# EAGLE design breakout (EAGLE 9.1.2)
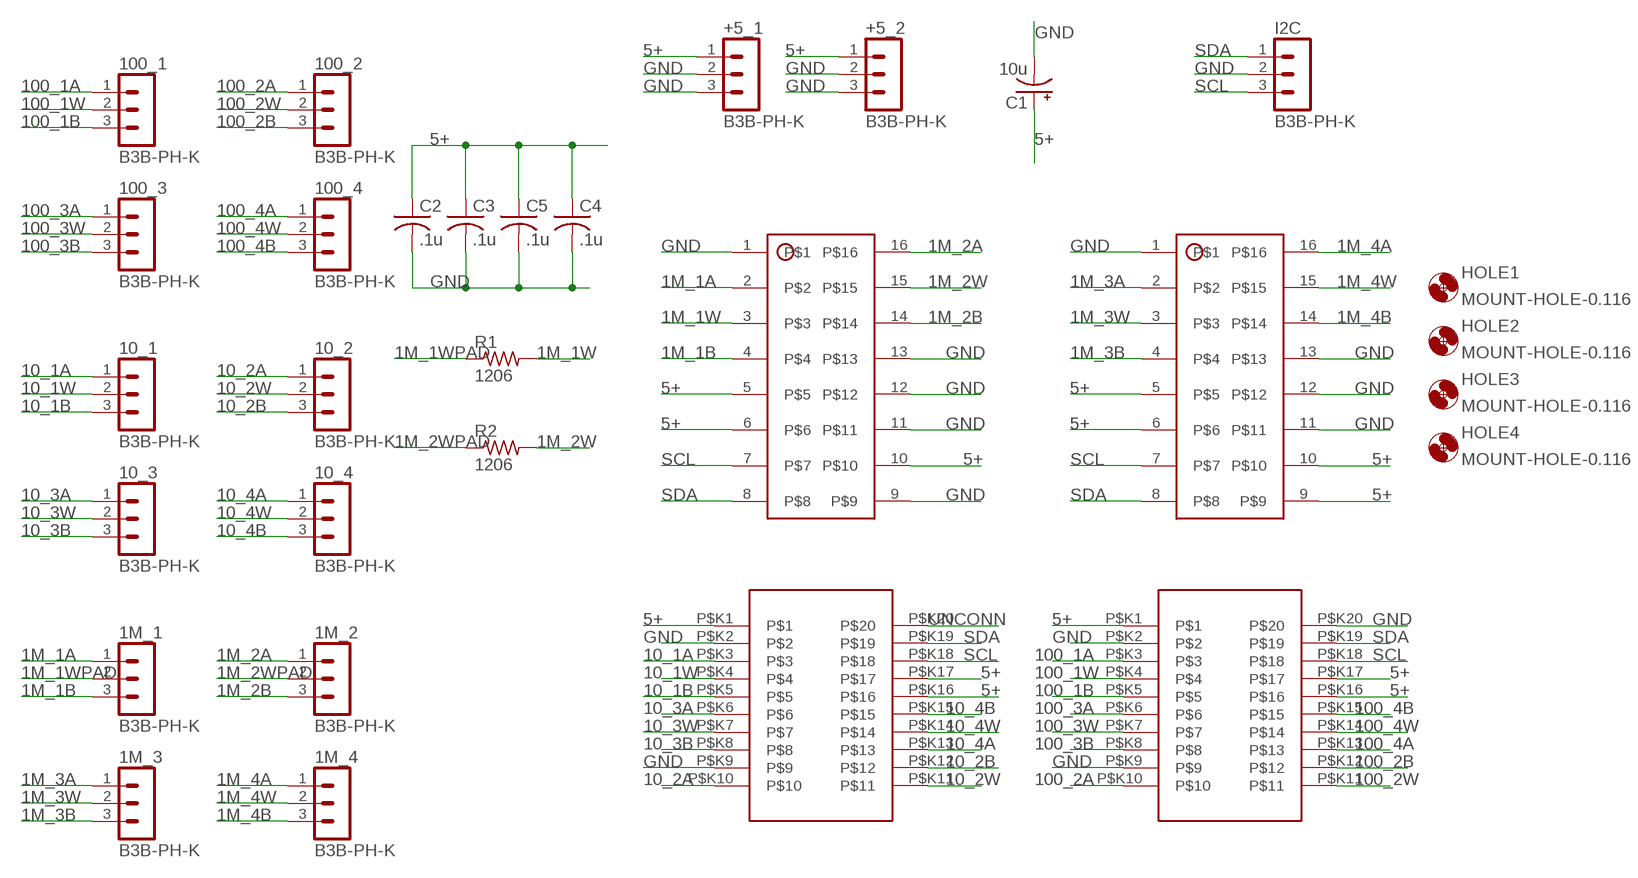
[diagram p0: schematic, sheet 1]

## Parts
1M_1  B3B-PH-K  [B3B-PH-K]
1M_2  B3B-PH-K  [B3B-PH-K]
1M_3  B3B-PH-K  [B3B-PH-K]
1M_4  B3B-PH-K  [B3B-PH-K]
10_1  B3B-PH-K  [B3B-PH-K]
10_2  B3B-PH-K  [B3B-PH-K]
10_3  B3B-PH-K  [B3B-PH-K]
10_4  B3B-PH-K  [B3B-PH-K]
10K  TSSOP20  [TSSOP20]
100_1  B3B-PH-K  [B3B-PH-K]
100_2  B3B-PH-K  [B3B-PH-K]
100_3  B3B-PH-K  [B3B-PH-K]
100_4  B3B-PH-K  [B3B-PH-K]
100K  TSSOP20  [TSSOP20]
+5_1  B3B-PH-K  [B3B-PH-K]
+5_2  B3B-PH-K  [B3B-PH-K]
C1  10u  CPOL-USE3.5-8  [E3,5-8]
C2  .1u  C-USC1206K  [C1206K]
C3  .1u  C-USC1206K  [C1206K]
C4  .1u  C-USC1206K  [C1206K]
C5  .1u  C-USC1206K  [C1206K]
HOLE1  MOUNT-HOLE-0.116  [116]
HOLE2  MOUNT-HOLE-0.116  [116]
HOLE3  MOUNT-HOLE-0.116  [116]
HOLE4  MOUNT-HOLE-0.116  [116]
I2C  B3B-PH-K  [B3B-PH-K]
MEG_1  SOIC-16  [SOIC127P600X175-16N]
MEG_2  SOIC-16  [SOIC127P600X175-16N]
R1  1206  R-US_R1206  [R1206]
R2  1206  R-US_R1206  [R1206]

## Nets
1M_1A: 1M_1.1 MEG_1.2
1M_1B: 1M_1.3 MEG_1.4
1M_1W: MEG_1.3 R1.2
1M_1WPAD: 1M_1.2 R1.1
1M_2A: 1M_2.1 MEG_1.16
1M_2B: 1M_2.3 MEG_1.14
1M_2W: MEG_1.15 R2.2
1M_2WPAD: 1M_2.2 R2.1
1M_3A: 1M_3.1 MEG_2.2
1M_3B: 1M_3.3 MEG_2.4
1M_3W: 1M_3.2 MEG_2.3
1M_4A: 1M_4.1 MEG_2.16
1M_4B: 1M_4.3 MEG_2.14
1M_4W: 1M_4.2 MEG_2.15
5+: 10K.P$K1 10K.P$K16 10K.P$K17 100K.P$K1 100K.P$K16 100K.P$K17 +5_1.1 +5_2.1 C1.+ C2.1 C3.1 C4.1 C5.1 MEG_1.5 MEG_1.6 MEG_1.10 MEG_2.5 MEG_2.6 MEG_2.9 MEG_2.10
10_1A: 10_1.1 10K.P$K3
10_1B: 10_1.3 10K.P$K5
10_1W: 10_1.2 10K.P$K4
10_2A: 10_2.1 10K.P$K10
10_2B: 10_2.3 10K.P$K12
10_2W: 10_2.2 10K.P$K11
10_3A: 10_3.1 10K.P$K6
10_3B: 10_3.3 10K.P$K8
10_3W: 10_3.2 10K.P$K7
10_4A: 10_4.1 10K.P$K13
10_4B: 10_4.3 10K.P$K15
10_4W: 10_4.2 10K.P$K14
100_1A: 100_1.1 100K.P$K3
100_1B: 100_1.3 100K.P$K5
100_1W: 100_1.2 100K.P$K4
100_2A: 100_2.1 100K.P$K10
100_2B: 100_2.3 100K.P$K12
100_2W: 100_2.2 100K.P$K11
100_3A: 100_3.1 100K.P$K6
100_3B: 100_3.3 100K.P$K8
100_3W: 100_3.2 100K.P$K7
100_4A: 100_4.1 100K.P$K13
100_4B: 100_4.3 100K.P$K15
100_4W: 100_4.2 100K.P$K14
GND: 10K.P$K2 10K.P$K9 100K.P$K2 100K.P$K9 100K.P$K20 +5_1.2 +5_1.3 +5_2.2 +5_2.3 C1.- C2.2 C3.2 C4.2 C5.2 I2C.2 MEG_1.1 MEG_1.9 MEG_1.11 MEG_1.12 MEG_1.13 MEG_2.1 MEG_2.11 MEG_2.12 MEG_2.13
SCL: 10K.P$K18 100K.P$K18 I2C.3 MEG_1.7 MEG_2.7
SDA: 10K.P$K19 100K.P$K19 I2C.1 MEG_1.8 MEG_2.8
UNCONN: 10K.P$K20

## Library data of the parts
1M_1-1M_4 10_1-10_4 100_1-100_4 +5_1 +5_2 I2C = con-jst-ph:B3B-PH-K: HEADER
10K 100K = kevin:TSSOP20
C1 = rcl:CPOL-US: POLARIZED CAPACITOR, American symbol; SPICEPREFIX: C
C2-C5 = rcl:C-US: CAPACITOR, American symbol; SPICEPREFIX: C
HOLE1-HOLE4 = holes:MOUNT-HOLE-: MOUNTING HOLE with drill center marker; BOM: EXCLUDE
MEG_1 MEG_2 = EFM8BB10F8I-A-SOIC16:SOIC-16
R1 R2 = rcl:R-US_: RESISTOR, American symbol; SPICEPREFIX: R

## Board
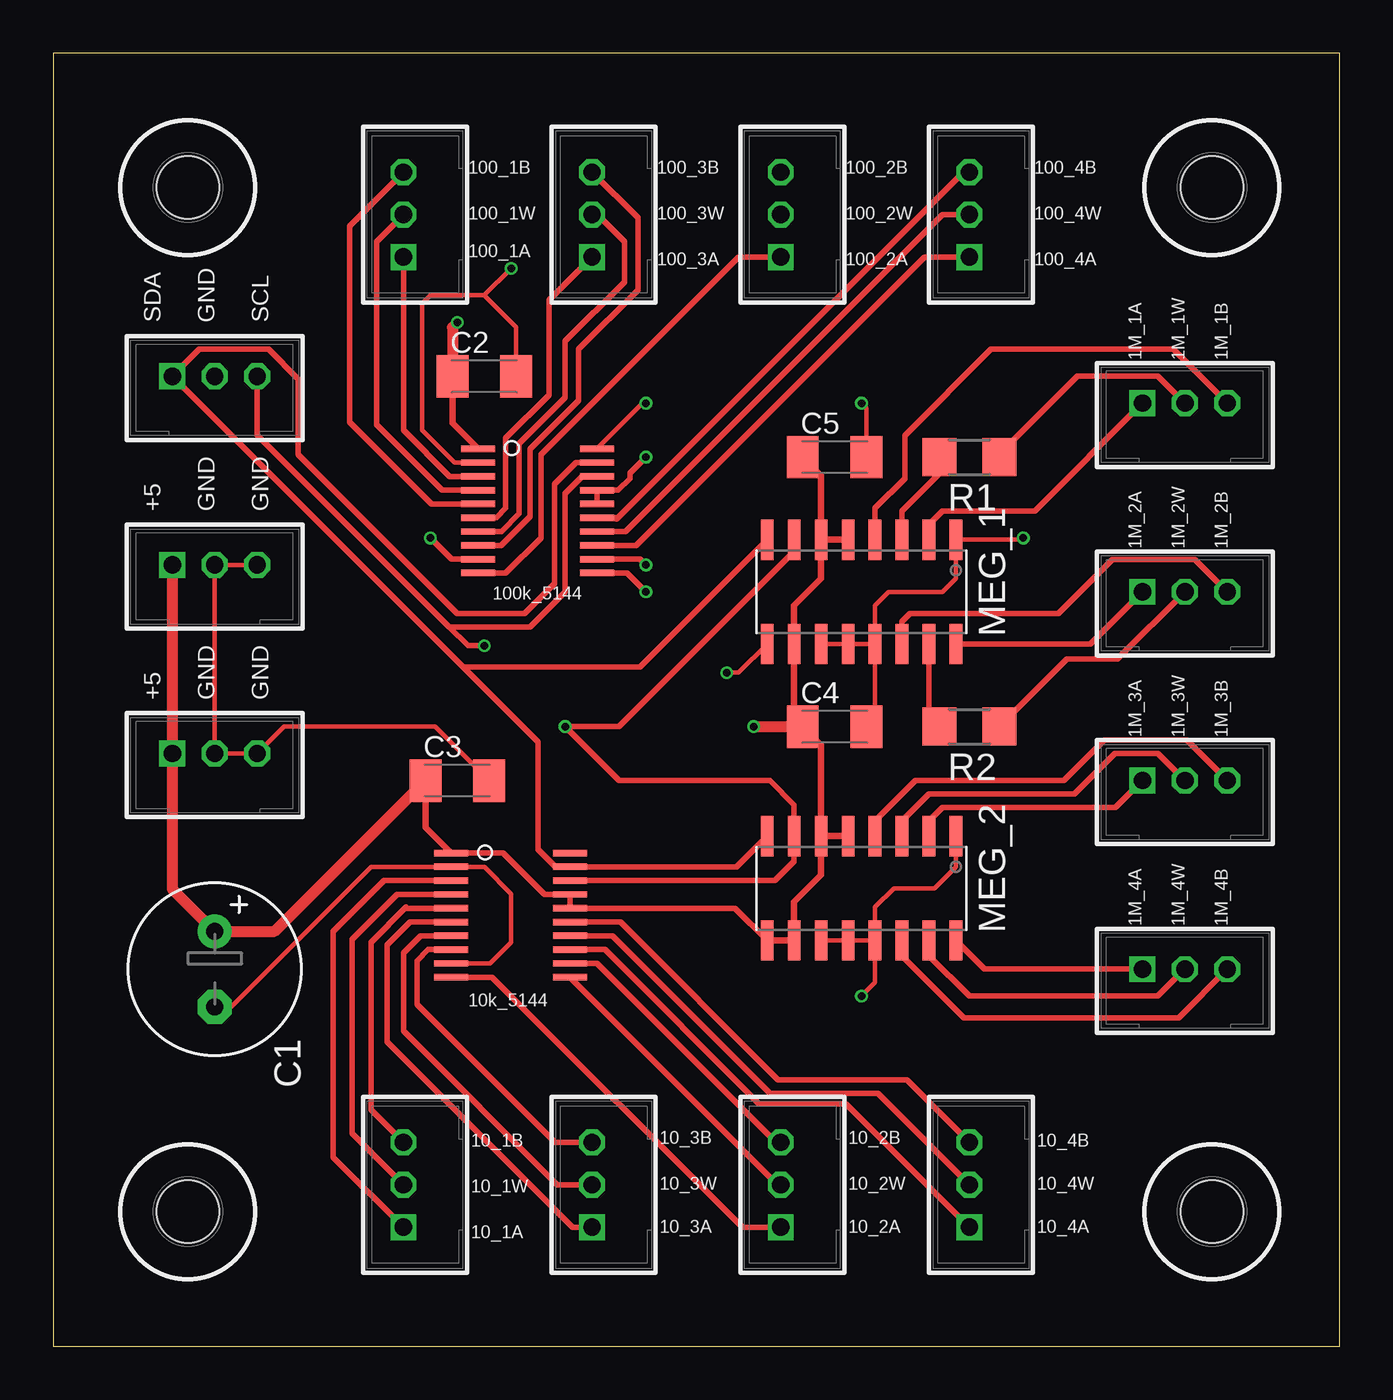
[diagram p1: board, top side]
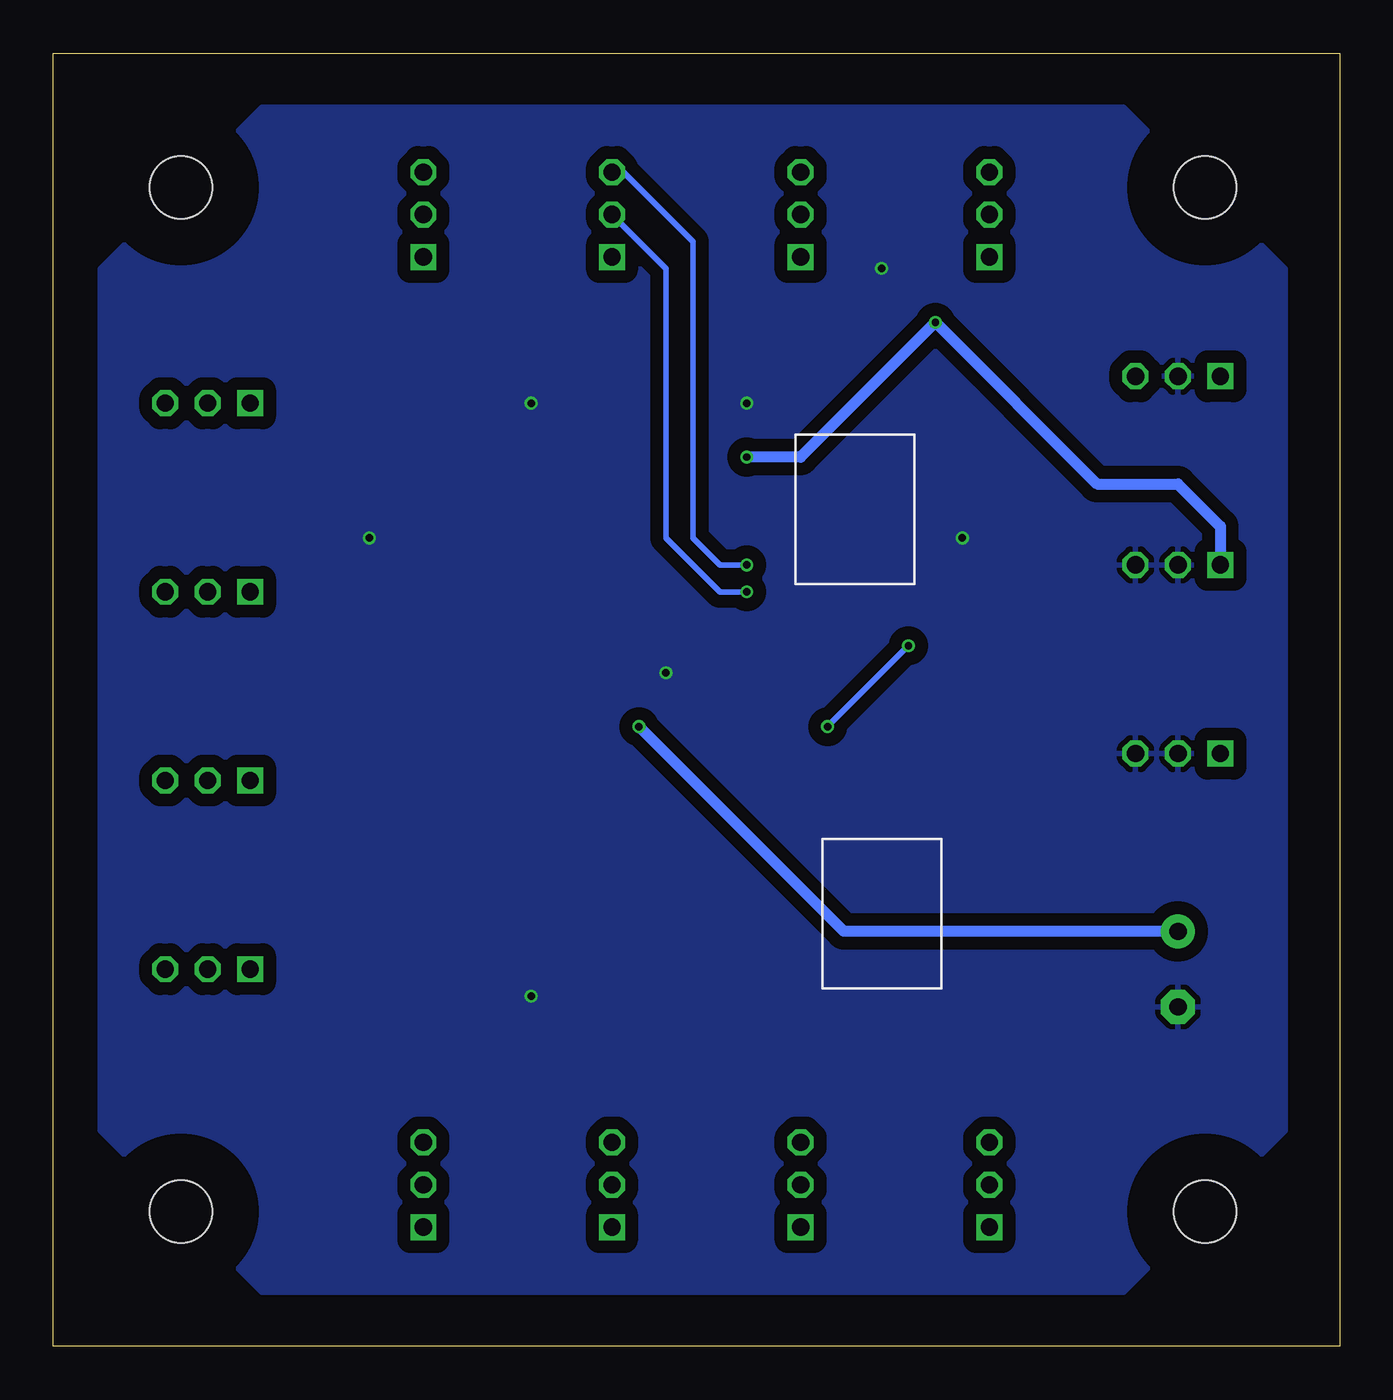
[diagram p2: board, bottom side, seen from below]

Size 60.63 x 60.95 mm. Coordinates in mm from the lower left corner, seen from the top.
Outline: 0,0 60.63,0 60.63,60.95 0,60.95 0,0
Copper layers (1*16): Top 0.035559375mm / dielectric 1.6mm / Bottom 0.035559375mm
Design rules "oshpark-2layer": minimum track width 6mil, minimum drill 10mil, track to track 6mil, track to pad 6mil, pad to pad 6mil, via to via 6mil, smd to smd 6mil, copper to edge 15mil, drill to drill 6mil, minimum pad ring 5mil, minimum via ring 5mil, stop-mask expansion 2.5mil, vias tented up to drill 0mil, thermal gap 10mil

### Footprints (pad centres in the part's own frame; a part is rotated, then mirrored left to right if it is on the bottom)
B3B-PH-K = drill 0.813 square: 1 -2,0 | drill 0.813 octagon: 2 0,0; 3 2,0
TSSOP20 = smd 0.3 x 1.6: P$K1 -2.93,-2.825; P$K2 -2.28,-2.825; P$K3 -1.63,-2.825; P$K4 -0.98,-2.825; P$K5 -0.33,-2.825; P$K6 0.32,-2.825; P$K7 0.97,-2.825; P$K8 1.62,-2.825; P$K9 2.27,-2.825; P$K10 2.92,-2.825; P$K11 2.92,2.775; P$K12 2.27,2.775; P$K13 1.62,2.775; P$K14 0.97,2.775; P$K15 0.32,2.775; P$K16 -0.33,2.775; P$K17 -0.98,2.775; P$K18 -1.63,2.775; P$K19 -2.28,2.775; P$K20 -2.93,2.775
E3,5-8 = drill 0.813 pad 1.6: + -1.778,0 | drill 0.813 pad 1.6 octagon: - 1.778,0
C1206K = smd 1.5 x 2: 1 -1.5,0; 2 1.5,0
116 = hole 2.946: 0,0
SOIC127P600X175-16N = smd 1.9 x 0.6: 1 -2.455,4.445; 2 -2.455,3.175; 3 -2.455,1.905; 4 -2.455,0.635; 5 -2.455,-0.635; 6 -2.455,-1.905; 7 -2.455,-3.175; 8 -2.455,-4.445; 9 2.455,-4.445; 10 2.455,-3.175; 11 2.455,-1.905; 12 2.455,-0.635; 13 2.455,0.635; 14 2.455,1.905; 15 2.455,3.175; 16 2.455,4.445
R1206 = smd 1.6 x 1.803: 1 -1.422,0; 2 1.422,0

### Placement (x,y rotation side)
1M_1  53.34,44.45 0 top
1M_2  53.34,35.56 0 top
1M_3  53.34,26.67 0 top
1M_4  53.34,17.78 0 top
10_1  16.51,7.62 90 top
10_2  34.29,7.62 90 top
10_3  25.4,7.62 90 top
10_4  43.18,7.62 90 top
10K  21.59,20.32 270 top
100_1  16.51,53.34 90 top
100_2  34.29,53.34 90 top
100_3  25.4,53.34 90 top
100_4  43.18,53.34 90 top
100K  22.86,39.37 270 top
+5_1  7.62,36.83 0 top
+5_2  7.62,27.94 0 top
C1  7.62,17.78 270 top
C2  20.32,45.72 0 top
C3  19.05,26.67 0 top
C4  36.83,29.21 0 top
C5  36.83,41.91 0 top
HOLE1  6.35,54.61 0 top
HOLE2  54.61,54.61 0 top
HOLE3  6.35,6.35 0 top
HOLE4  54.61,6.35 0 top
I2C  7.62,45.72 0 top
MEG_1  38.1,35.56 270 top
MEG_2  38.1,21.59 270 top
R1  43.18,41.91 180 top
R2  43.18,29.21 180 top

### Tracks (layer width: path | path; a pad name or v marks a point on that pad's centre or on a via)
1M_1A
  Top 0.254: MEG_1.2 41.27,38.73 41.91,39.37 46.26,39.37 1M_1.1
1M_1B
  Top 0.254: MEG_1.4 38.73,39.5 40.13,40.89 40.13,42.93 44.2,46.99 52.8,46.99 1M_1.3
1M_1W
  Top 0.254: MEG_1.3 40.01,39.37 41.76,41.12 R1.2
1M_1WPAD
  Top 0.254: 1M_1.2 52.07,45.72 48.26,45.72 44.6,42.06 R1.1
1M_2A
  Top 0.254: MEG_1.16 48.88,33.11 1M_2.1
1M_2B
  Top 0.254: MEG_1.14 40.01,34.16 40.39,34.54 47.37,34.54 49.91,37.08 53.82,37.08 1M_2.3
1M_2W
  Top 0.254: MEG_1.15 41.27,29.69 R2.2
1M_2WPAD
  Top 0.254: R2.1 47.78,32.39 50.16,32.39 1M_2.2
1M_3A
  Top 0.254: MEG_2.2 41.27,24.76 41.91,25.4 50.07,25.4 1M_3.1
1M_3B
  Top 0.254: MEG_2.4 38.73,24.76 40.64,26.67 47.62,26.67 49.53,28.57 53.44,28.57 1M_3.3
1M_3W
  Top 0.254: MEG_2.3 40.01,24.76 41.27,26.04 48.13,26.04 50.04,27.94 52.07,27.94 1M_3.2
1M_4A
  Top 0.254: MEG_2.16 43.9,17.78 1M_4.1
1M_4B
  Top 0.254: MEG_2.14 40.01,18.42 42.93,15.49 53.05,15.49 1M_4.3
1M_4W
  Top 0.254: MEG_2.15 41.27,18.42 43.18,16.51 52.07,16.51 1M_4.2
5+  (via drill 0.35)
  Top 0.254: 10K.P$K1 21.2,23.25 23.15,21.3 10K.P$K17 10K.P$K16 32.14,20.65 MEG_2.9 | v27.94,41.91 27.18,41.15 27.18,40.89 26.63,40.35 100K.P$K17 100K.P$K16
  Top 0.305: MEG_2.9 MEG_2.10 34.92,20.96 36.2,22.22 MEG_2.6 | MEG_2.6 MEG_2.5 | 10K.P$K1 17.55,24.46 C3.1 | MEG_2.6 36.2,28.35 C4.1 34.92,29.61 MEG_1.10 34.92,34.92 36.2,36.19 MEG_1.6 | MEG_1.6 MEG_1.5 | MEG_1.6 36.2,41.05 C5.1 | C2.1 18.82,43.52 100K.P$K1
  Top 0.508: +5_1.1 +5_2.1 5.62,21.56 C1.+ 10.44,19.56 C3.1 | v33.02,29.21 C4.1 | v19.05,48.26 18.82,48.03 C2.1
  Bottom 0.508: +5_1.1 5.62,38.64 7.62,40.64 11.43,40.64 v19.05,48.26 25.4,41.91 v27.94,41.91 | C1.+ 23.37,19.56 v33.02,29.21
10_1A
  Top 0.254: 10K.P$K3 15.6,21.95 13.21,19.56 13.21,8.92 10_1.1
10_1B
  Top 0.254: 10K.P$K5 16.69,20.65 16.64,20.7 14.99,19.05 14.99,11.14 10_1.3
10_1W
  Top 0.254: 10K.P$K4 16.22,21.3 14.1,19.18 14.1,10.03 10_1.2
10_2A
  Top 0.254: 10K.P$K10 20.7,17.4 32.48,5.62 10_2.1
10_2B
  Top 0.254: 10K.P$K12 25.64,18.05 34.07,9.62 10_2.3
10_2W
  Top 0.254: 10K.P$K11 34.15,7.62 10_2.2
10_3A
  Top 0.254: 10K.P$K6 16.82,20 15.75,18.92 15.75,14.35 24.48,5.62 10_3.1
10_3B
  Top 0.254: 10K.P$K8 17.68,18.7 17.14,18.16 17.14,16.13 23.65,9.62 10_3.3
10_3W
  Top 0.254: 10K.P$K7 17.32,19.35 16.51,18.54 16.51,14.86 23.75,7.62 10_3.2
10_4A
  Top 0.254: 10K.P$K13 26,18.7 33.27,11.43 37.37,11.43 10_4.1
10_4B
  Top 0.254: 10K.P$K15 26.74,20 34.16,12.57 40.23,12.57 10_4.3
10_4W
  Top 0.254: 10K.P$K14 26.37,19.35 33.78,11.94 38.86,11.94 10_4.2
100_1A
  Top 0.254: 100K.P$K3 18.69,41 16.51,43.18 100_1.1
100_1B
  Top 0.254: 100K.P$K5 17.83,39.7 13.97,43.56 13.97,52.8 100_1.3
100_1W
  Top 0.254: 100K.P$K4 18.32,40.35 15.24,43.43 15.24,52.07 100_1.2
100_2A
  Top 0.254: 100K.P$K10 21.34,36.45 22.99,38.1 22.99,42.04 32.29,51.34 100_2.1
100_2B  (via drill 0.35)
  Top 0.254: 100K.P$K12 27.67,37.1 v27.94,36.83
  Bottom 0.254: v27.94,36.83 29.21,36.83 30.48,38.1 30.48,52.07 33.75,55.34 100_2.3
100_2W  (via drill 0.35)
  Top 0.254: 100K.P$K11 27.05,36.45 v27.94,35.56
  Bottom 0.254: v27.94,35.56 29.21,35.56 31.75,38.1 31.75,50.8 100_2.2
100_3A
  Top 0.254: 100K.P$K6 20.89,39.05 21.34,39.5 21.34,42.8 23.37,44.83 23.37,49.31 100_3.1
100_3B
  Top 0.254: 100K.P$K8 21.11,37.75 22.48,39.12 22.48,42.29 24.77,44.58 24.77,46.99 27.56,49.78 27.56,53.18 100_3.3
100_3W
  Top 0.254: 100K.P$K7 21.13,38.4 21.97,39.24 21.97,42.55 24.13,44.7 24.13,47.37 26.92,50.17 26.92,52.07 25.65,53.34 100_3.2
100_4A
  Top 0.254: 100K.P$K13 27.46,37.75 41.05,51.34 100_4.1
100_4B
  Top 0.254: 100K.P$K15 26.48,39.05 26.54,38.99 42.89,55.34 100_4.3
100_4W
  Top 0.254: 100K.P$K14 26.97,38.4 41.91,53.34 100_4.2
GND  (via drill 0.35)
  Top 0.203: +5_1.3 +5_1.2 +5_2.2 +5_2.3 10.89,29.21 18.01,29.21 C3.2 | MEG_2.11 MEG_2.12 MEG_2.13 | MEG_2.13 38.73,20.7 39.62,21.59 41.53,21.59 42.55,22.61 MEG_2.1 | C4.2 38.73,29.61 MEG_1.13 | MEG_1.13 MEG_1.12 MEG_1.11 | MEG_1.13 38.73,34.92 39.37,35.56 41.91,35.56 42.55,36.19 MEG_1.1 45.63,38.02 v45.72,38.1 | 100K.P$K20 27.79,44.45 v27.94,44.45 | 100K.P$K2 18.93,41.65 17.4,43.18 17.4,49.15 17.78,49.53 20.32,49.53 | C2.2 21.82,48.03 20.32,49.53 | 10K.P$K9 20.59,18.05 21.59,19.05 21.59,21.34 20.33,22.6 10K.P$K2 14.98,22.6 8.38,16 C1.- | MEG_2.13 38.73,17.14 v38.1,16.51 | C5.2 38.33,44.22 v38.1,44.45 | MEG_1.9 32.3,31.75 v31.75,31.75 | 20.32,49.53 v21.59,50.8
  Top 0.254: 100K.P$K9 18.78,37.1 v17.78,38.1
  pour Bottom (isolate 0.61): 10.16,58.42 50.8,58.42 58.42,50.8 58.42,10.16 50.8,2.54 10.16,2.54 2.54,10.16 2.54,50.8
SCL  (via drill 0.35)
  Top 0.254: I2C.3 9.62,42.96 18.67,33.91 | 10K.P$K18 34.02,21.95 34.92,22.86 MEG_2.7 34.92,25.53 33.78,26.67 26.67,26.67 v24.13,29.21 26.67,29.21 34.92,37.47 MEG_1.7 | 18.67,33.91 22.48,33.91 24.13,35.56 24.13,40.19 | 18.67,33.91 19.56,33.02 v20.32,33.02 | 24.13,40.19 | 24.13,40.19 24.94,41 100K.P$K18
  Bottom 0.254: v20.32,33.02 v24.13,29.21
SDA
  Top 0.203: 100K.P$K19 25.4,41.65
  Top 0.254: 19.32,32.02 I2C.1 6.89,46.99 10.16,46.99 11.56,45.59 11.56,42.04 19.05,34.54 21.59,34.54 22.23,34.54 23.62,35.94 23.62,40.64 24.64,41.66 24.64,41.65 25.4,41.65 | 19.32,32.02 22.86,28.48 22.86,23.41 23.67,22.6 10K.P$K19 32.21,22.6 MEG_2.8 | 19.32,32.02 27.66,32.02 MEG_1.8

### Text on the board
tPlace: 100_1B | 100_3B | 100_2B | 100_4B | 100_1W | 100_3W | 100_2W | 100_4W | 100_1A | 100_3A | 100_2A | 100_4A | SDA | GND | SCL | 1M_1A | 1M_1W | 1M_1B | +5 | GND | GND | 1M_2A | 1M_2W | 1M_2B | 100k_5144 | +5 | GND | GND | 1M_3A | 1M_3W | 1M_3B | 1M_4A | 1M_4W | 1M_4B | 10k_5144 | 10_3B | 10_2B | 10_1B | 10_4B | 10_1W | 10_3W | 10_2W | 10_4W | 10_1A | 10_3A | 10_2A | 10_4A